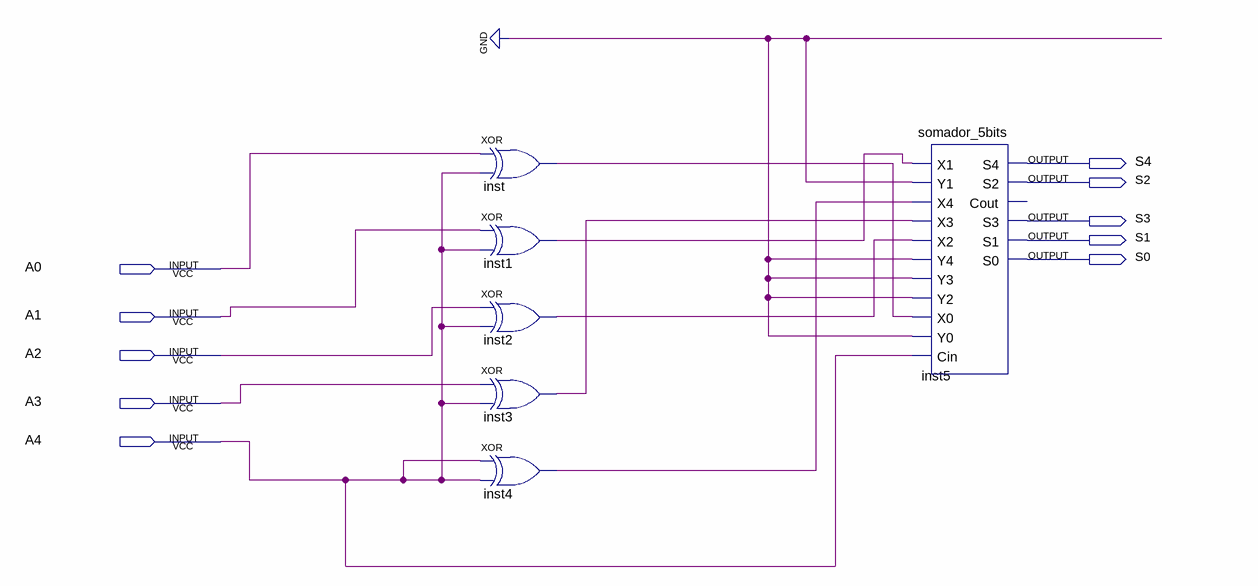
[diagram p0: schematic sheet]
// Quartus schematic conversor_complemento.bdf as structural Verilog: 6 symbols, 10 pins
module conversor_complemento (
  input  A0,
  input  A1,
  input  A2,
  input  A3,
  input  A4,
  output S4,
  output S2,
  output S3,
  output S1,
  output S0
);

  wire inst1_out, inst2_out, inst3_out, inst4_out, inst_out;

  xor inst (inst_out, A0, A4);
  xor inst1 (inst1_out, A1, A4);
  xor inst2 (inst2_out, A2, A4);
  xor inst3 (inst3_out, A3, A4);
  xor inst4 (inst4_out, A4, A4);
  somador_5bits inst5 (
    .X1(inst1_out), .Y1(1'b0), .X4(inst4_out), .X3(inst3_out), .X2(inst2_out), .Y4(1'b0), .Y3(1'b0),
    .Y2(1'b0), .X0(inst_out), .Y0(1'b0), .Cin(A4), .S4(S4), .S2(S2), .S3(S3), .S1(S1), .S0(S0));  // open: Cout
endmodule
